# Altium schematic sheet ESP_BASE.SchDoc
size A3
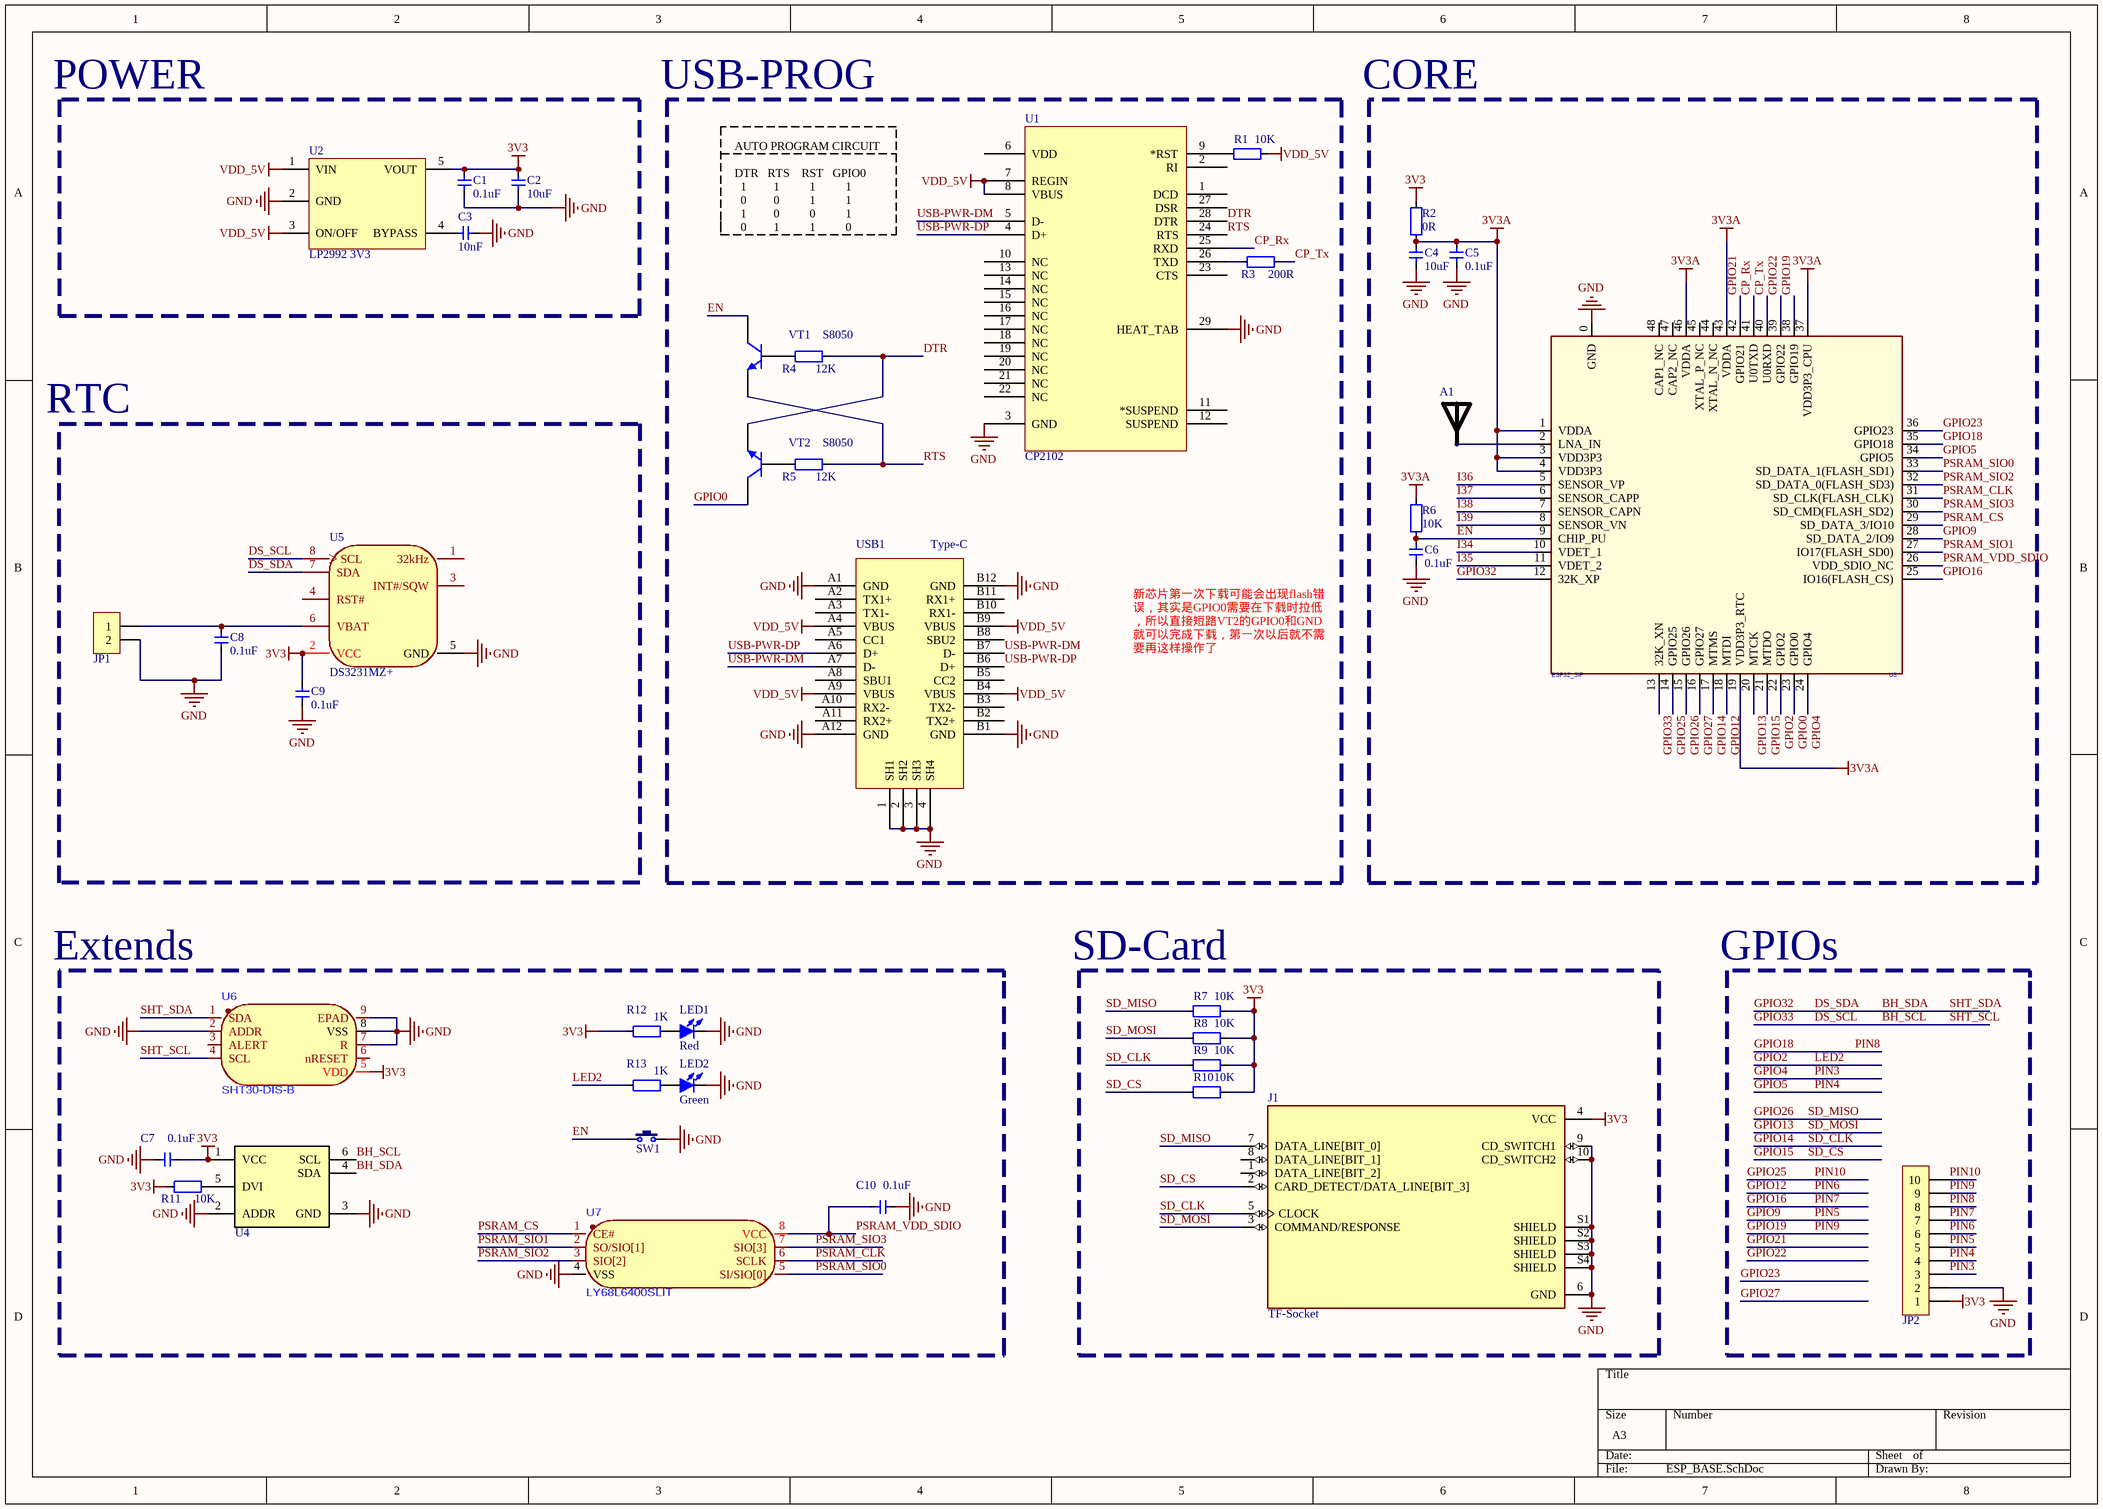
[diagram p0: ESP_BASE.SchDoc]

## Parts
A1  RAINSUN  [ANT-Rainsun-AN5120]  (value not drawn)
C1  0.1uF  [CAP_0402]
C2  10uF  [CAP_0402]
C3  10nF  [CAP_0402]
C4  10uF  [CAP_0402]
C5  0.1uF  [CAP_0402]
C6  0.1uF  [CAP_0402]
C7  0.1uF  [CAP_0402]
C8  0.1uF  [CAP_0402]
C9  0.1uF  [CAP_0402]
C10  0.1uF  [CAP_0402]
J1  TF-Socket  [TF-Card-Amphenol with TF]
JP1  MX 1.25-WS-2P  [MX 1.25-WS-2P]  (value not drawn)
JP2  HDR-1X10  [HDR2.54-LI-10P]  (value not drawn)
LED1  Red  [LED 0603R]
LED2  Green  [LED 0603G]
R1  10K  [RES_0402]
R2  0R  [RES_0402]
R3  200R  [RES_0402]
R4  12K  [RES_0402]
R5  12K  [RES_0402]
R6  10K  [RES_0402]
R7  10K  [RES_0402]
R8  10K  [RES_0402]
R9  10K  [RES_0402]
R10  10K  [RES_0402]
R11  10K  [RES_0402]
R12  1K  [RES_0402]
R13  1K  [RES_0402]
SW1  3x6x5  [TSW SMD-3*6*2.5]  (value not drawn)
U1  CP2102  [QFN-28]
U2  LP2992 3V3  [SOT23-5]
U3  ESP32_SIP  [QFN-48_7X7]
U4  BH1750FVI-TR  [BH1750FVI]  (value not drawn)
U5  DS3231MZ+  [SO8_L]
U6  SHT30-DIS-B  [DFN-8_L2.5-W2.5-P0.50-BL-EP]
U7  LY68L6400SLIT  [SOP-8_150MIL]
USB1  Type-C  [Type-C-TOP]
VT1  S8050  [SMT_TRIODE_NPN]
VT2  S8050  [SMT_TRIODE_NPN]

## Nets
3V3: C1.2 C2.2 C7.1 C9.1 J1.4(VCC) JP2.1 R2.1 R7.1 R8.1 R9.1 R10.1 R11.2 R12.2 U2.5(VOUT) U4.1(VCC) U5.2(VCC) U6.5(VDD)
3V3A: C4.2 C5.2 R2.2 R6.1 U3.1(VDDA) U3.3(VDD3P3) U3.4(VDD3P3) U3.19(VDD3P3_RTC) U3.37(VDD3P3_CPU) U3.43(VDDA) U3.46(VDDA)
GND: C1.1 C2.1 C3.1 C4.1 C5.1 C6.2 C7.2 C8.2 C9.2 C10.1 J1.6(GND) J1.9(CD_SWITCH1) J1.10(CD_SWITCH2) J1.S1(SHIELD) J1.S2(SHIELD) J1.S3(SHIELD) J1.S4(SHIELD) JP1.2 JP2.2 LED1.2(K) LED2.2(K) SW1.2 U1.3(GND) U1.29(HEAT_TAB) U2.2(GND) U3.0(GND) U4.2(ADDR) U4.3(GND) U5.5(GND) U6.2(ADDR) U6.7(R) U6.8(VSS) U6.9(EPAD) U7.4(VSS) USB1.1(SH1) USB1.2(SH2) USB1.3(SH3) USB1.4(SH4) USB1.A1(GND) USB1.A12(GND) USB1.B1(GND) USB1.B12(GND)
VDD_5V: R1.1 U1.7(REGIN) U1.8(VBUS) U2.1(VIN) U2.3(ON/OFF) USB1.A4(VBUS) USB1.A9(VBUS) USB1.B4(VBUS) USB1.B9(VBUS)
BH_SCL: U3.13(32K_XN) U4.6(SCL) U5.8(SCL) U6.4(SCL)  [also labelled DS_SCL, GPIO33, SHT_SCL]
BH_SDA: U3.12(32K_XP) U4.4(SDA) U5.7(SDA) U6.1(SDA)  [also labelled DS_SDA, GPIO32, SHT_SDA]
CP_Rx: U1.25(RXD) U3.41(U0TXD)
CP_Tx: R3.1 U3.40(U0RXD)
DTR: R4.1 U1.28(DTR) VT2.2(E)
EN: C6.1 R6.2 SW1.1 U3.9(CHIP_PU) VT1.3(C)
GPIO0: U3.23(GPIO0) VT2.3(C)
GPIO2: R13.2 U3.22(GPIO2)  [also labelled LED2]
GPIO4: JP2.3 U3.24(GPIO4)  [also labelled PIN3]
GPIO5: JP2.4 U3.34(GPIO5)  [also labelled PIN4]
GPIO9: JP2.5 U3.28(SD_DATA_2/IO9)  [also labelled PIN5]
GPIO12: JP2.6 U3.18(MTDI)  [also labelled PIN6]
GPIO13: J1.3(COMMAND/RESPONSE) R8.2 U3.20(MTCK)  [also labelled SD_MOSI]
GPIO14: J1.5(CLOCK) R9.2 U3.17(MTMS)  [also labelled SD_CLK]
GPIO15: J1.2(CARD_DETECT/DATA_LINE[BIT_3]) R10.2 U3.21(MTDO)  [also labelled SD_CS]
GPIO16: JP2.7 U3.25(IO16(FLASH_CS))  [also labelled PIN7]
GPIO18: JP2.8 U3.35(GPIO18)  [also labelled PIN8]
GPIO19: JP2.9 U3.38(GPIO19)  [also labelled PIN9]
GPIO21: U3.42(GPIO21)
GPIO22: U3.39(GPIO22)
GPIO23: U3.36(GPIO23)
GPIO25: JP2.10 U3.14(GPIO25)  [also labelled PIN10]
GPIO26: J1.7(DATA_LINE[BIT_0]) R7.2 U3.15(GPIO26)  [also labelled SD_MISO]
GPIO27: U3.16(GPIO27)
I34: U3.10(VDET_1)
I35: U3.11(VDET_2)
I36: U3.5(SENSOR_VP)
I37: U3.6(SENSOR_CAPP)
I38: U3.7(SENSOR_CAPN)
I39: U3.8(SENSOR_VN)
PSRAM_CLK: U3.31(SD_CLK(FLASH_CLK)) U7.6(SCLK)
PSRAM_CS: U3.29(SD_DATA_3/IO10) U7.1(CE#)
PSRAM_SIO0: U3.33(SD_DATA_1(FLASH_SD1)) U7.5(SI/SIO[0])
PSRAM_SIO1: U3.27(IO17(FLASH_SD0)) U7.2(SO/SIO[1])
PSRAM_SIO2: U3.32(SD_DATA_0(FLASH_SD3)) U7.3(SIO[2])
PSRAM_SIO3: U3.30(SD_CMD(FLASH_SD2)) U7.7(SIO[3])
PSRAM_VDD_SDIO: C10.2 U3.26(VDD_SDIO_NC) U7.8(VCC)
RTS: R5.1 U1.24(RTS) VT1.2(E)
USB-PWR-DM: U1.5(D-) USB1.A7(D-) USB1.B7(D-)
USB-PWR-DP: U1.4(D+) USB1.A6(D+) USB1.B6(D+)
NetA1_1: A1.1 U3.2(LNA_IN)
NetC3_2: C3.2 U2.4(BYPASS)
NetC8_1: C8.1 JP1.1 U5.6(VBAT)
NetLED1_1: LED1.1(A) R12.1
NetLED2_1: LED2.1(A) R13.1
NetR1_2: R1.2 U1.9(*RST)
NetR3_2: R3.2 U1.26(TXD)
NetR4_2: R4.2 VT1.1(B)
NetR5_2: R5.2 VT2.1(B)
NetR11_1: R11.1 U4.5(DVI)

Not connected (* = marked no-connect by the designer): J1 1(DATA_LINE[BIT_2]) 8(DATA_LINE[BIT_1]); U1 1(DCD) 2(RI) 6(VDD) 10(NC) 11(*SUSPEND) 12(SUSPEND) 13(NC) 14(NC) 15(NC) 16(NC) 17(NC) 18(NC) 19(NC) 20(NC) 21(NC) 22(NC) 23(CTS) 27(DSR); U3 44(XTAL_N_NC) 45(XTAL_P_NC) 47(CAP2_NC) 48(CAP1_NC); U5 1(32kHz) 3(INT#/SQW) 4(RST#); U6 3(ALERT) 6(nRESET); USB1 A2(TX1+) A3(TX1-) A5(CC1) A8(SBU1) A10(RX2-) A11(RX2+) B2(TX2+) B3(TX2-) B5(CC2) B8(SBU2) B10(RX1-) B11(RX1+)

## Notes on the sheet
- POWER
- USB-PROG
- CORE
- AUTO PROGRAM CIRCUIT
  DTR   RTS    RST   GPIO0
  1         1          1          1
  0         0          1          1
  1         0          0          1
  0         1          1          0
- RTC
- 新芯片第一次下载可能会出现flash错误，其实是GPIO0需要在下载时拉低，所以直接短路VT2的GPIO0和GND就可以完成下载，第一次以后就不需要再这样操作了
- (near U6) Extends
- (near R7) SD-Card
- GPIOs

## Library data of the parts
A1 = ANT-Rainsun-AP5120
C1-C10 = 电容-0402: Capacitor; Value: 0.1u
J1 = TF-Socket: 10 _8 + 2_ Position Card Connector Secure Digital - microSDâ„¢ Surface Mount, Right Angle Gold; MP: 1140084168; MF: Amphenol Commercial Products; SnapEDA_Link: https://www.snapeda.com/parts/1140084168/Amphenol/view-part/4544529/?ref=snap; Availability: Unavailable; Price: None; Value: *; Package: None
JP1 = MX 1.25-WS-2P: 2P接插件; BOM名称: 2P接插件
JP2 = Header 10: 10P接插件; BOM名称: 10P接插件
LED1 LED2 = LED-SMD: 贴片LED; BOM名称: 贴片LED
R1-R13 = 电阻-0402: Resistor; Value: 22R
SW1 = TSW 3x6: 3x6轻触开关; BOM名称: 3x6轻触开关
U1 = CP2102: USB转TTL; PART DESC: SINGLE-CHIP USB TO UART BRIDGE, QFN28, RoHS.; MFG #1: SILICON LABS; PART NUMBER: CP2102; Value: Value; RefDes: RefDes; Type: DEV
U2 = LP2992: LDO
U3 = ESP32-PICO
U7 = LY68L6400SLIT: PSRAM
USB1 = USB-Type-C-TOP
VT1 VT2 = SMT_TRIODE_NPN: Surface mount NPN transistor, package SOT-23